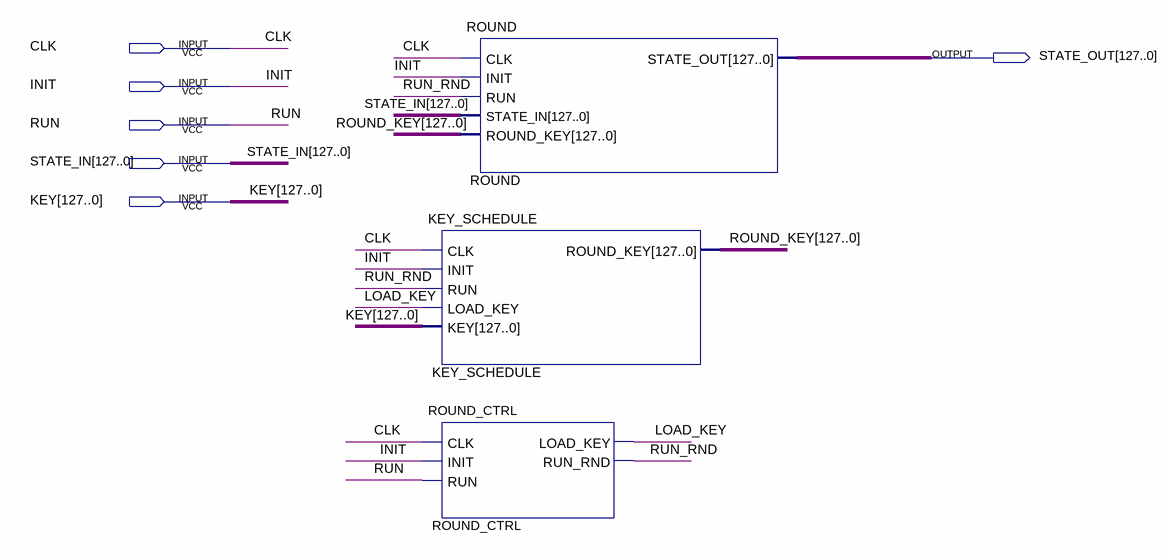
[diagram p0: schematic sheet]
// Quartus schematic EK.bdf as structural Verilog: 3 symbols, 6 pins
module EK (
  input  CLK,
  input  INIT,
  input  RUN,
  input  [127:0] STATE_IN,
  input  [127:0] KEY,
  output [127:0] STATE_OUT
);

  wire LOAD_KEY, RUN_RND;
  wire [127:0] ROUND_KEY;

  ROUND ROUND (
    .CLK(CLK), .INIT(INIT), .RUN(RUN_RND), .STATE_IN(STATE_IN), .ROUND_KEY(ROUND_KEY), .STATE_OUT(STATE_OUT));
  KEY_SCHEDULE KEY_SCHEDULE (
    .CLK(CLK), .INIT(INIT), .RUN(RUN_RND), .LOAD_KEY(LOAD_KEY), .KEY(KEY), .ROUND_KEY(ROUND_KEY));
  ROUND_CTRL ROUND_CTRL (.CLK(CLK), .INIT(INIT), .RUN(RUN), .LOAD_KEY(LOAD_KEY), .RUN_RND(RUN_RND));
endmodule
